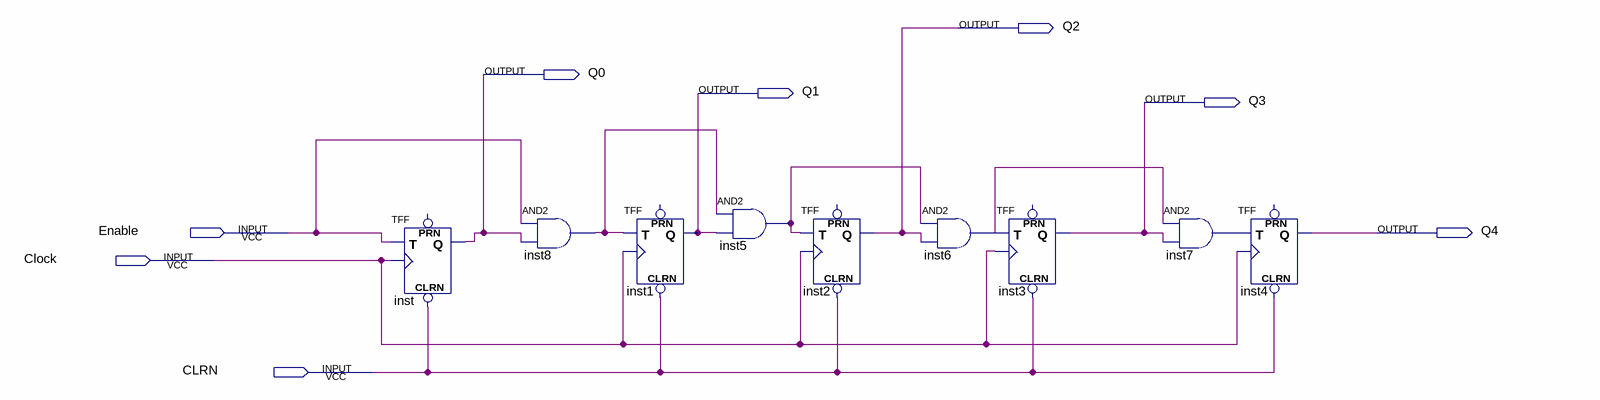
[diagram p0: schematic sheet]
// Quartus schematic lab10step2b.bdf as structural Verilog: 9 symbols, 8 pins
module lab10step2b (
  input  Enable,
  input  Clock,
  input  CLRN,
  output Q2,
  output Q0,
  output Q1,
  output Q3,
  output Q4
);

  wire inst5_out, inst6_out, inst7_out, inst8_out;

  TFF inst (.CLRN(CLRN), .T(Enable), .CLK(Clock), .Q(Q0));  // open: PRN
  and inst8 (inst8_out, Enable, Q0);
  TFF inst1 (.CLRN(CLRN), .T(inst8_out), .CLK(Clock), .Q(Q1));  // open: PRN
  and inst5 (inst5_out, inst8_out, Q1);
  TFF inst2 (.CLRN(CLRN), .T(inst5_out), .CLK(Clock), .Q(Q2));  // open: PRN
  and inst6 (inst6_out, inst5_out, Q2);
  TFF inst3 (.CLRN(CLRN), .T(inst6_out), .CLK(Clock), .Q(Q3));  // open: PRN
  and inst7 (inst7_out, inst6_out, Q3);
  TFF inst4 (.CLRN(CLRN), .T(inst7_out), .CLK(Clock), .Q(Q4));  // open: PRN
endmodule
